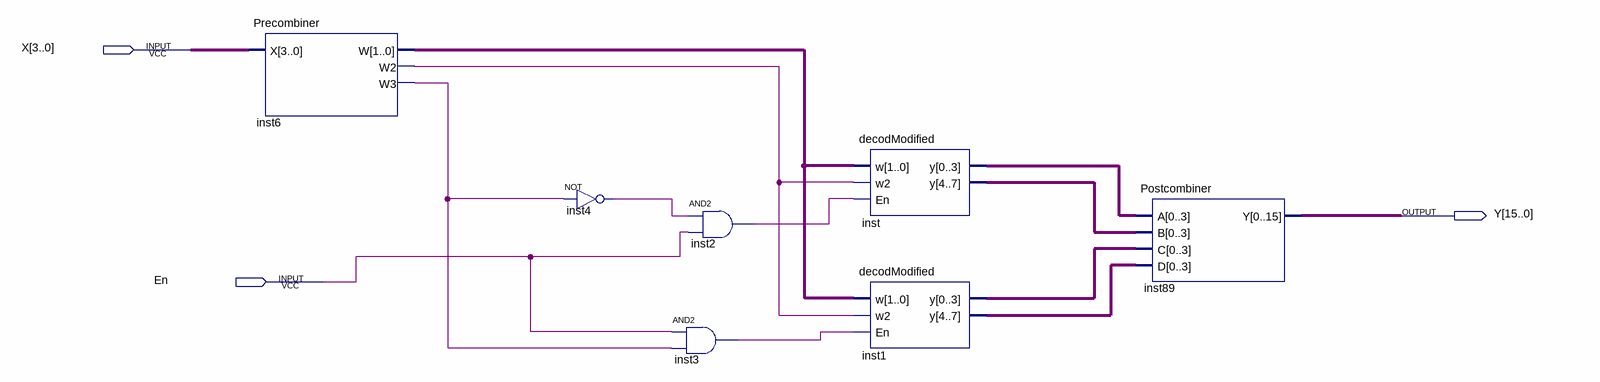
[diagram p0: schematic sheet]
// Quartus schematic Decoder1.bdf as structural Verilog: 7 symbols, 3 pins
module Decoder1 (
  input  [3:0] X,
  input  En,
  output [15:0] Y
);

  wire inst2_out, inst3_out, inst4_out, inst6_w2, inst6_w3;
  wire [1:0] inst6_w;
  wire [3:0] inst1_y, inst1_y_2, inst_y, inst_y_2;

  Precombiner inst6 (.X(X), .W(inst6_w), .W2(inst6_w2), .W3(inst6_w3));
  not inst4 (inst4_out, inst6_w3);
  and inst2 (inst2_out, inst4_out, En);
  and inst3 (inst3_out, En, inst6_w3);
  decodModified inst (
    .w(inst6_w), .w2(inst6_w2), .En(inst2_out),
    .y({inst_y_2[0], inst_y_2[1], inst_y_2[2], inst_y_2[3], inst_y[0], inst_y[1], inst_y[2], inst_y[3]}));
  decodModified inst1 (
    .w(inst6_w), .w2(inst6_w2), .En(inst3_out),
    .y({inst1_y_2[0], inst1_y_2[1], inst1_y_2[2], inst1_y_2[3], inst1_y[0], inst1_y[1], inst1_y[2], inst1_y[3]}));
  Postcombiner inst89 (.A(inst_y), .B(inst_y_2), .C(inst1_y), .D(inst1_y_2), .Y(Y));
endmodule
